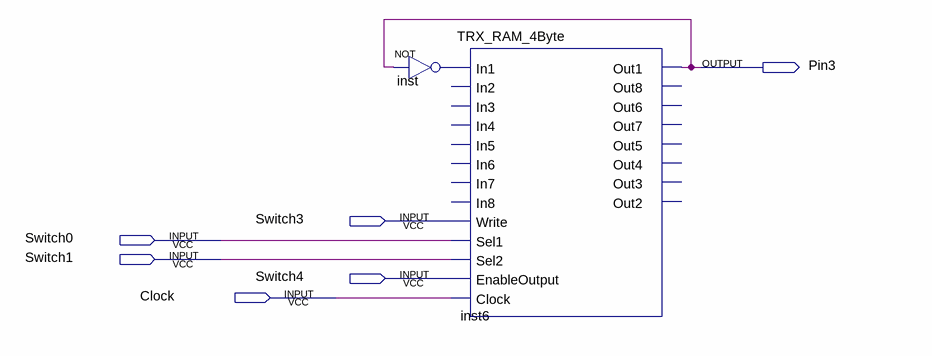
[diagram p0: schematic sheet]
// Quartus schematic TRX_CPU.bdf as structural Verilog: 2 symbols, 6 pins
module TRX_CPU (
  input  Switch3,
  input  Switch0,
  input  Switch1,
  input  Switch4,
  input  Clock,
  output Pin3
);

  wire inst_out;

  not inst (inst_out, Pin3);
  TRX_RAM_4Byte inst6 (
    .In1(inst_out), .Write(Switch3), .Sel1(Switch0), .Sel2(Switch1), .EnableOutput(Switch4), .Clock(Clock),
    .Out1(Pin3));  // open: In2, In3, In4, In5, In6, In7, In8, Out8, Out6, Out7, Out5, Out4, Out3, Out2
endmodule
